# EAGLE design KGM 9DOF v2.0 (EAGLE 6.1)
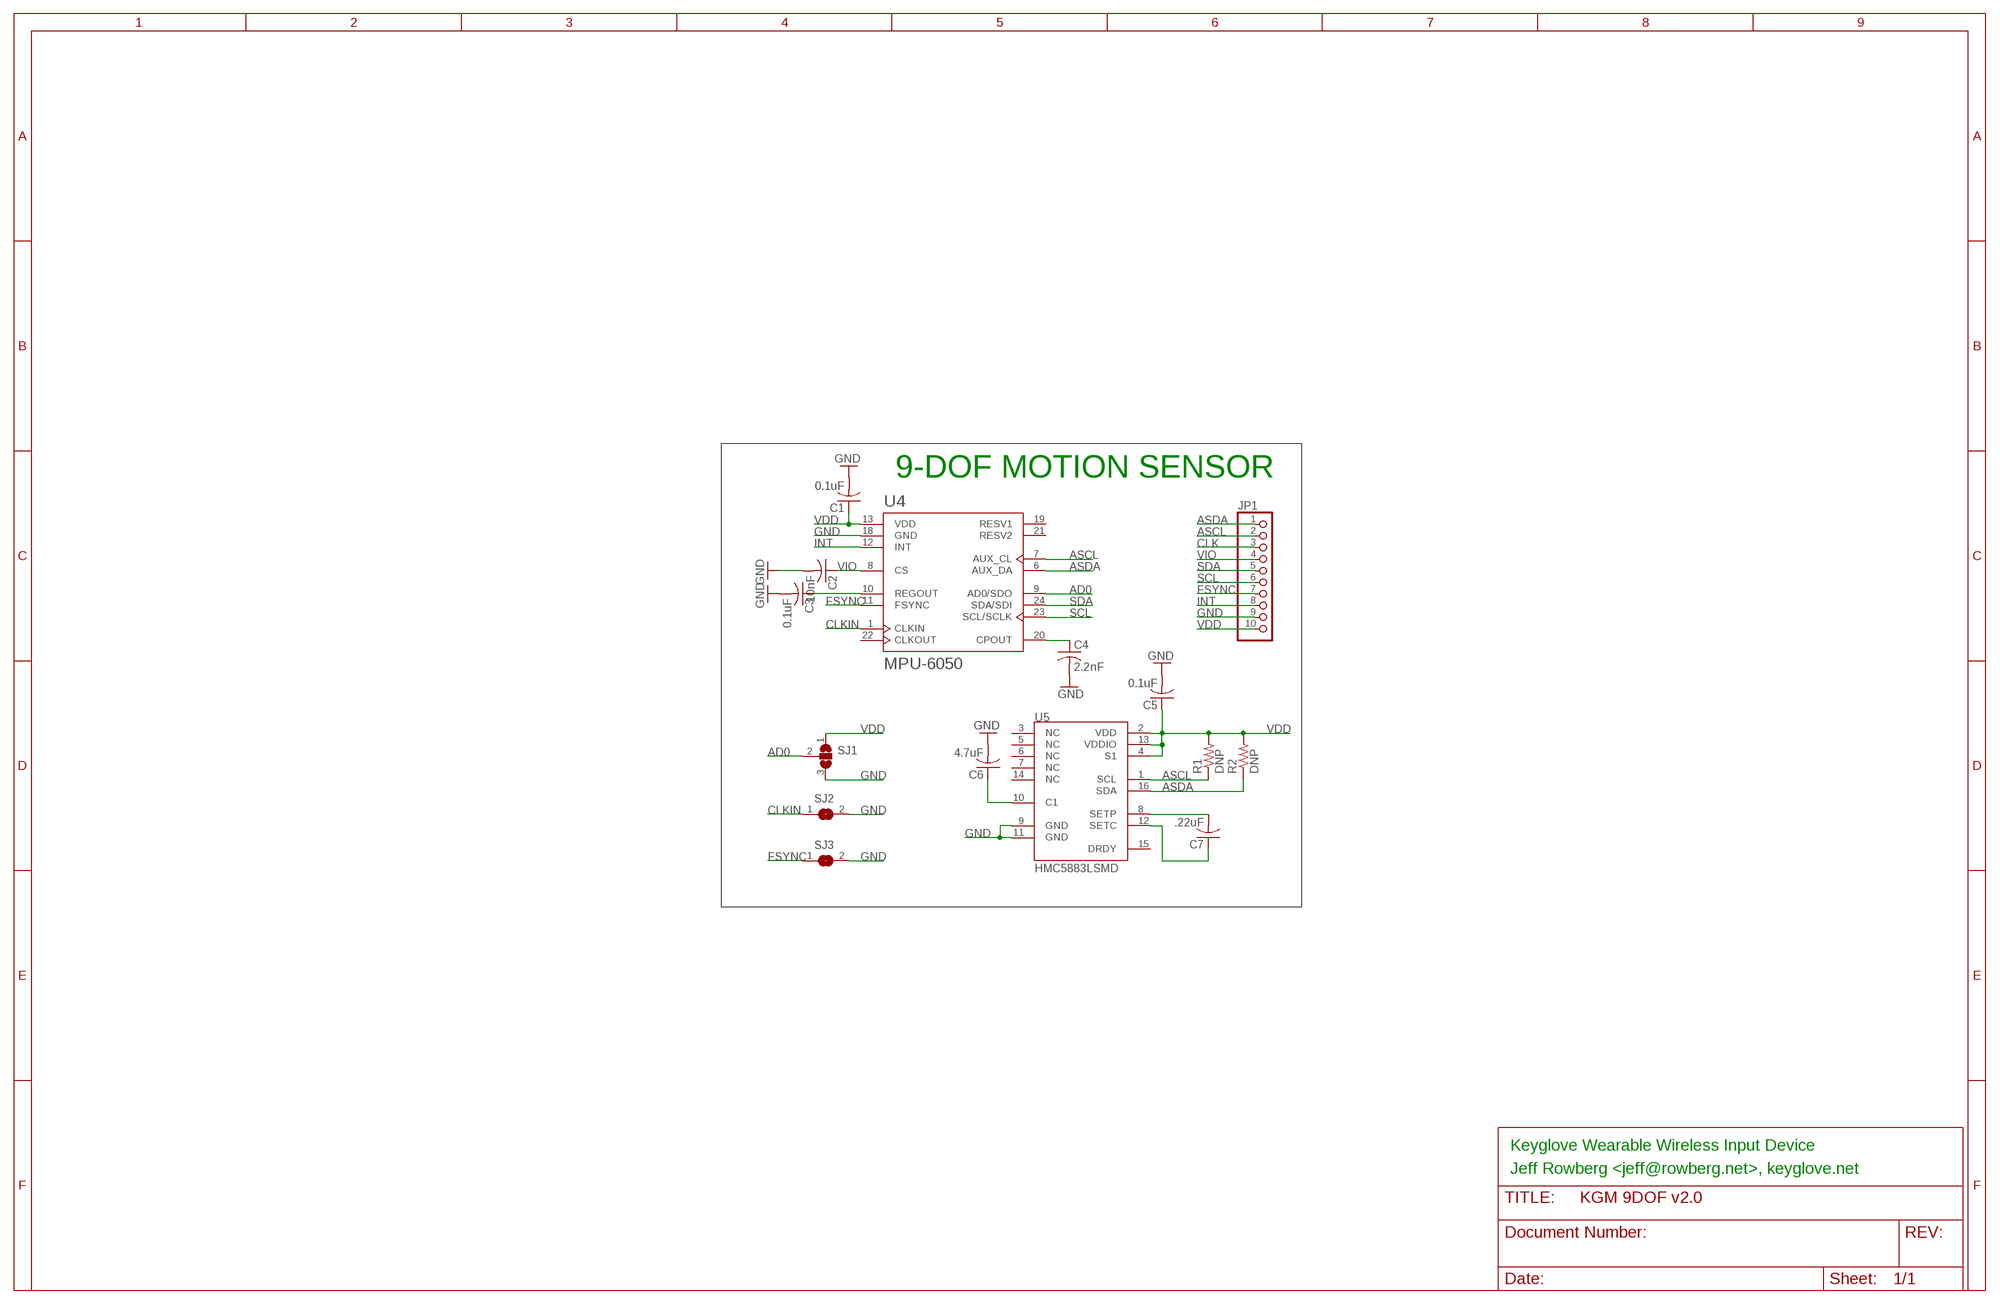
[diagram p0: schematic, sheet 1]

## Parts
C1  0.1uF  C-USC0603  [C0603]
C2  10nF  C-USC0603  [C0603]
C3  0.1uF  C-USC0603  [C0603]
C4  2.2nF  C-USC0603  [C0603]
C5  0.1uF  C-USC0603  [C0603]
C6  4.7uF  C-USC0603  [C0603]
C7  .22uF  C-USC0603  [C0603]
JP1  PINHD-1X10  [1X10]
R1  DNP  R-US_R0603  [R0603]
R2  DNP  R-US_R0603  [R0603]
SJ1  SJ2W  [SJ_2]
SJ2  SJ  [SJ]
SJ3  SJ  [SJ]
U4  MPU-6050  MPU-6000  [QFN24MPU]
U5  HMC5883LSMD  [16LPCC]

## Nets
AD0: SJ1.2 U4.9(AD0/SDO)
ASCL: JP1.2 R1.1 U4.7(AUX_CL) U5.1(SCL)
ASDA: JP1.1 R2.1 U4.6(AUX_DA) U5.16(SDA)
CLK: JP1.3
CLKIN: SJ2.1 U4.1(CLKIN)
FSYNC: JP1.7 SJ3.1 U4.11(FSYNC)
GND [power]: C1.2 C2.2 C3.2 C4.2 C5.2 C6.2 JP1.9 SJ1.3 SJ2.2 SJ3.2 U4.18(GND) U5.9(GND) U5.11(GND)
INT: JP1.8 U4.12(INT)
N$1: C6.1 U5.10(C1)
N$7: C7.2 U5.8(SETP)
N$10: C7.1 U5.12(SETC)
N$16: C4.1 U4.20(CPOUT)
N$17: C3.1 U4.10(REGOUT)
SCL: JP1.6 U4.23(SCL/SCLK)
SDA: JP1.5 U4.24(SDA/SDI)
VDD [power]: C1.1 C5.1 JP1.10 R1.2 R2.2 SJ1.1 U4.13(VDD) U5.2(VDD) U5.4(S1) U5.13(VDDIO)
VIO: C2.1 JP1.4 U4.8(CS)
Unconnected: U4.19(RESV1) U4.21(RESV2) U4.22(CLKOUT) U5.3(NC) U5.5(NC) U5.6(NC) U5.7(NC) U5.14(NC) U5.15(DRDY)

## Notes on the sheet
- 9-DOF MOTION SENSOR
- Keyglove Wearable Wireless Input Device
- Jeff Rowberg <jeff@rowberg.net>, keyglove.net

## Library data of the parts
C1-C7 = resistor:C-US: CAPACITOR, American symbol
JP1 = sf-pinhead:PINHD-1X10: PIN HEADER
R1 R2 = resistor:R-US_: RESISTOR, American symbol
SJ1 = jumper:SJ2W: SMD solder JUMPER
SJ2 SJ3 = jumper:SJ: SMD solder JUMPER
U4 = sf-invensense:MPU-6000
U5 = SparkFun:HMC5883L: 3 Axis Digital Compass IC

## Net classes
0 default: width 0.254 mm, drill 0.305 mm, clearance 0.152 mm
1 power: width 0.254 mm, drill 0.305 mm, clearance 0.152 mm

## Board
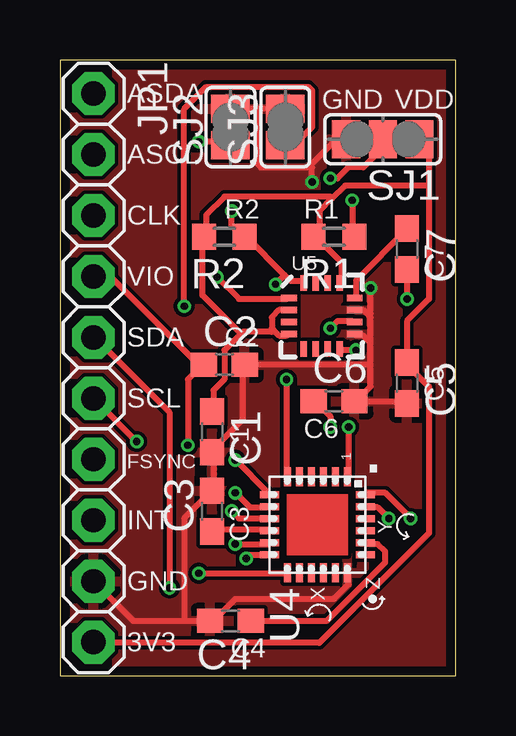
[diagram p1: board, top side]
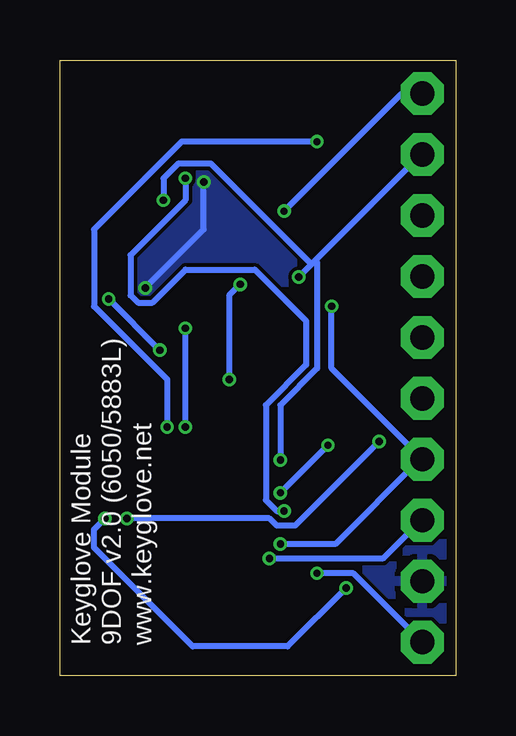
[diagram p2: board, bottom side, seen from below]

Size 16.51 x 25.65 mm. Coordinates in mm from the lower left corner, seen from the top.
Outline: 0,0 16.51,0 16.51,25.65 0,25.65 0,0
Copper layers (1*16): Top 0.0356mm / dielectric 1.5011mm / Bottom 0.0356mm
Design rules: minimum track width 6mil, minimum drill 12mil, track to track 6mil, track to pad 6mil, pad to pad 6mil, via to via 6mil, smd to smd 6mil, copper to edge 15mil, drill to drill 6mil, minimum pad ring 6mil, minimum via ring 5mil, stop-mask expansion 4mil, vias tented up to drill 20mil, thermal gap 10mil

### Footprints (pad centres in the part's own frame; a part is rotated, then mirrored left to right if it is on the bottom)
C0603 = smd 1.1 x 1: 1 -0.85,0; 2 0.85,0
1X10 = drill 1.016 pad 1.778 octagon: 1 -11.43,0; 2 -8.89,0; 3 -6.35,0; 4 -3.81,0; 5 -1.27,0; 6 1.27,0; 7 3.81,0; 8 6.35,0; 9 8.89,0; 10 11.43,0
R0603 = smd 1 x 1.1: 1 -0.85,0; 2 0.85,0
SJ_2 = smd 1.168 x 1.6: 1 -1.524,0; 2 0,0; 3 1.524,0
SJ = smd 1.168 x 1.6: 1 -0.762,0; 2 0.762,0
QFN24MPU = smd 0.8 x 0.3: 1 -2,1.25; 2 -2,0.75; 3 -2,0.25; 4 -2,-0.25; 5 -2,-0.75; 6 -2,-1.25; 13 2,-1.25; 14 2,-0.75; 15 2,-0.25; 16 2,0.25; 17 2,0.75; 18 2,1.25 | smd 0.3 x 0.8: 7 -1.25,-2; 8 -0.75,-2; 9 -0.25,-2; 10 0.25,-2; 11 0.75,-2; 12 1.25,-2; 19 1.25,2; 20 0.75,2; 21 0.25,2; 22 -0.25,2; 23 -0.75,2; 24 -1.25,2
16LPCC = smd 0.65 x 0.28: 1 -1.37,0.75; 2 -1.37,0.25; 3 -1.37,-0.25; 4 -1.37,-0.75; 9 1.37,-0.75; 10 1.37,-0.25; 11 1.37,0.25; 12 1.37,0.75 | smd 0.28 x 0.65: 5 -0.75,-1.37; 6 -0.25,-1.37; 7 0.25,-1.37; 8 0.75,-1.37; 13 0.75,1.37; 14 0.25,1.37; 15 -0.25,1.37; 16 -0.75,1.37

### Placement (x,y rotation side)
C1  6.35,10.16 270 top
C2  6.86,12.95 0 top
C3  6.35,6.86 90 top
C4  7.11,2.29 180 top
C5  14.48,12.19 270 top
C6  11.43,11.43 0 top
C7  14.48,17.78 270 top
JP1  1.4,12.83 270 top
R1  11.43,18.29 180 top
R2  6.86,18.29 180 top
SJ1  13.46,22.35 180 top
SJ2  7.11,22.86 90 top
SJ3  9.4,22.86 90 top
U4  10.74,6.29 270 top
U5  10.92,14.99 0 top

### Tracks (layer width: path | path; a pad name or v marks a point on that pad's centre or on a via)
AD0  (via drill 0.3)
  Top 0.254: v7.16,6.86 7.47,6.55 8.69,6.55 U4.9 | v11.28,20.73 11.58,20.73 12.04,21.18 12.65,21.18 13.41,21.95 13.41,22.25 SJ1.2
  Bottom 0.254: v7.16,6.86 7.47,6.86 7.92,7.32 7.92,11.28 6.25,12.95 6.25,14.78 8.38,16.92 11.28,16.92 12.65,15.54 13.26,15.54 13.56,15.85 13.56,17.53 11.28,19.81 v11.28,20.73
ASCL  (via drill 0.3)
  Top 0.254: v6.55,16.61 7.47,15.7 9.45,15.7 U5.1 | v7.32,8.99 8.69,7.62 U4.7 | v12.19,19.81 12.19,18.29 R1.1
  Bottom 0.254: 5.87,17.3 1.52,21.64 JP1.2 | 5.87,17.3 6.02,17.14 | 6.02,17.14 v6.55,16.61 | v7.32,8.99 7.32,11.28 5.79,12.8 5.79,17.22 5.87,17.3 | v12.19,19.81 12.19,20.73 11.58,21.34 10.21,21.34 6.02,17.14
ASDA  (via drill 0.3)
  Top 0.254: 9.37,16.69 7.77,18.29 R2.1 7.62,18.29 7.16,18.75 v7.16,19.36 | 9.37,16.69 9.6,16.46 10.06,16.46 U5.16 | v9.45,12.34 9.45,8.38 U4.6 | 9.37,16.69 v8.99,16.31
  Bottom 0.254: v9.45,12.34 9.45,15.85 v8.99,16.31 | v7.16,19.36 2.29,24.23 1.52,24.23 JP1.1
CLKIN  (via drill 0.3)
  Top 0.254: v12.04,10.36 12.04,8.38 U4.1 | v5.79,22.25 6.86,22.25 7.01,22.1 SJ2.1
  Bottom 0.254: v12.04,10.36 12.04,12.34 15.09,15.39 15.09,18.59 11.43,22.25 v5.79,22.25
FSYNC  (via drill 0.3)
  Top 0.254: v7.32,5.49 8.69,5.49 U4.11 | SJ3.1 9.75,22.1 10.52,22.86 10.52,24.38 10.36,24.54 6.1,24.54 5.18,23.62 v5.18,15.39
  Bottom 0.254: v7.32,5.49 5.03,5.49 1.52,8.99 JP1.7 5.18,12.8 v5.18,15.39
GND  (via drill 0.3)
  Top 0.254: U4.18 12.04,4.27 12.04,3.81 11.43,3.2 7.32,3.2 6.4,2.29 C4.2 5.18,2.29 | 5.18,2.29 3.05,2.29 JP1.9 | SJ3.2 8.23,23.62 | 8.23,23.62 SJ2.2 | 10.44,21.26 10.36,21.18 8.38,21.18 8.23,21.34 8.23,23.62 | 10.44,21.26 11.43,22.25 11.89,22.25 SJ1.3 | 12.88,13.95 12.95,13.87 12.95,12.95 | 12.88,13.95 12.65,14.17 12.34,14.17 U5.9 | 12.95,12.95 12.95,12.04 12.34,11.43 C6.2 14.48,11.43 C5.2 | 12.88,15.01 12.95,14.94 12.95,14.02 12.88,13.95 | 12.88,15.01 12.65,15.24 12.34,15.24 U5.11 | 12.95,12.95 C2.2 7.62,12.95 7.62,10.67 6.4,9.45 C1.2 6.4,9.3 6.4,7.77 C3.2 6.25,7.62 5.18,6.55 5.18,2.29 | v10.52,20.57 10.52,21.18 10.44,21.26 | v12.95,16.15 12.95,15.09 12.88,15.01
  Bottom 0.254: v10.52,20.57 10.52,18.59 v12.95,16.15
  pour Top: 0.25,25.4 16.26,25.4 16.26,0.25 0.25,0.25
  pour Bottom: 0.25,25.4 16.26,25.4 16.26,0.25 0.25,0.25
INT  (via drill 0.3)
  Top 0.254: v7.77,4.88 7.92,5.03 8.69,5.03 U4.12
  Bottom 0.254: v7.77,4.88 3.05,4.88 1.52,6.4 JP1.8
N$1  (via drill 0.3)
  Top 0.254: v11.28,14.48 11.58,14.78 12.19,14.78 U5.10 | v11.28,10.36 11.28,10.82 10.67,11.43 C6.1
  Bottom 0.254: v11.28,10.36 v11.28,14.48
N$7  (via drill 0.3)
  Top 0.254: v12.34,13.56 11.73,13.56 U5.8 | C7.2 v14.48,15.7
  Bottom 0.254: v14.48,15.7 v12.34,13.56
N$10
  Top 0.254: U5.12 12.34,15.85 12.34,16.46 14.48,18.59 C7.1
N$16
  Top 0.254: C4.1 11.12,2.29 13.56,4.72 13.56,5.18 13.26,5.49 12.8,5.49 U4.20
N$17
  Top 0.254: U4.10 8.69,6.1 6.4,6.1 C3.1
SCL  (via drill 0.3)
  Top 0.254: v13.72,6.55 13.26,7.01 12.8,7.01 U4.23 | JP1.6 v3.2,9.75
  Bottom 0.254: v13.72,6.55 7.77,6.55 7.47,6.25 6.71,6.25 v3.2,9.75
SDA  (via drill 0.3)
  Top 0.254: v14.63,6.55 13.56,7.62 12.8,7.62 U4.24 | v4.57,3.66 4.57,10.97 1.52,14.02 JP1.5
  Bottom 0.254: v14.63,6.55 15.09,6.1 15.09,5.33 10.97,1.22 7.01,1.22 v4.57,3.66
VDD  (via drill 0.3)
  Top 0.254: v5.79,4.27 9.45,4.27 U4.13 | 8.91,14.4 8.84,14.48 8.84,14.94 9.14,15.24 9.45,15.24 U5.2 | 8.91,14.4 9.14,14.17 9.45,14.17 U5.4 | 7.54,14.25 7.62,14.33 8.84,14.33 8.91,14.4 | 7.54,14.25 6.86,13.56 6.86,12.34 6.4,11.89 6.4,11.12 C1.1 | 7.54,14.25 5.94,15.85 5.94,18.29 R2.2 6.1,18.29 6.1,19.2 6.86,19.96 11.28,19.96 11.35,19.89 | U5.13 11.73,16.46 11.73,17.22 10.67,18.29 R1.2 10.82,18.29 10.82,19.36 11.35,19.89 | 15.39,20.42 15.39,21.95 SJ1.1 | 15.39,20.42 15.39,15.7 14.48,14.78 C5.1 14.48,12.95 15.39,12.04 15.39,5.94 10.82,1.37 1.52,1.37 JP1.10 | 11.35,19.89 11.89,20.42 15.39,20.42
  Bottom 0.254: v5.79,4.27 4.27,4.27 JP1.10
VIO  (via drill 0.3)
  Top 0.254: v7.32,7.62 7.92,7.01 8.69,7.01 U4.8 | v5.33,9.6 5.33,12.34 5.94,12.95 C2.1 5.79,12.95 2.13,16.61 1.52,16.61 JP1.4
  Bottom 0.254: v5.33,9.6 v7.32,7.62

### Text on the board
tPlace: ASDA | GND | VDD | ASCL | CLK | R2 | R1 | C7 | VIO | SDA | C2 | SCL | C5 | C6 | FSYNC | C1 | INT | C3 | GND | 3V3 | C4
bPlace: www.keyglove.net | 9DOF v2.0 (6050/5883L) | Keyglove Module